# EAGLE design expansion (EAGLE 9.6.2)
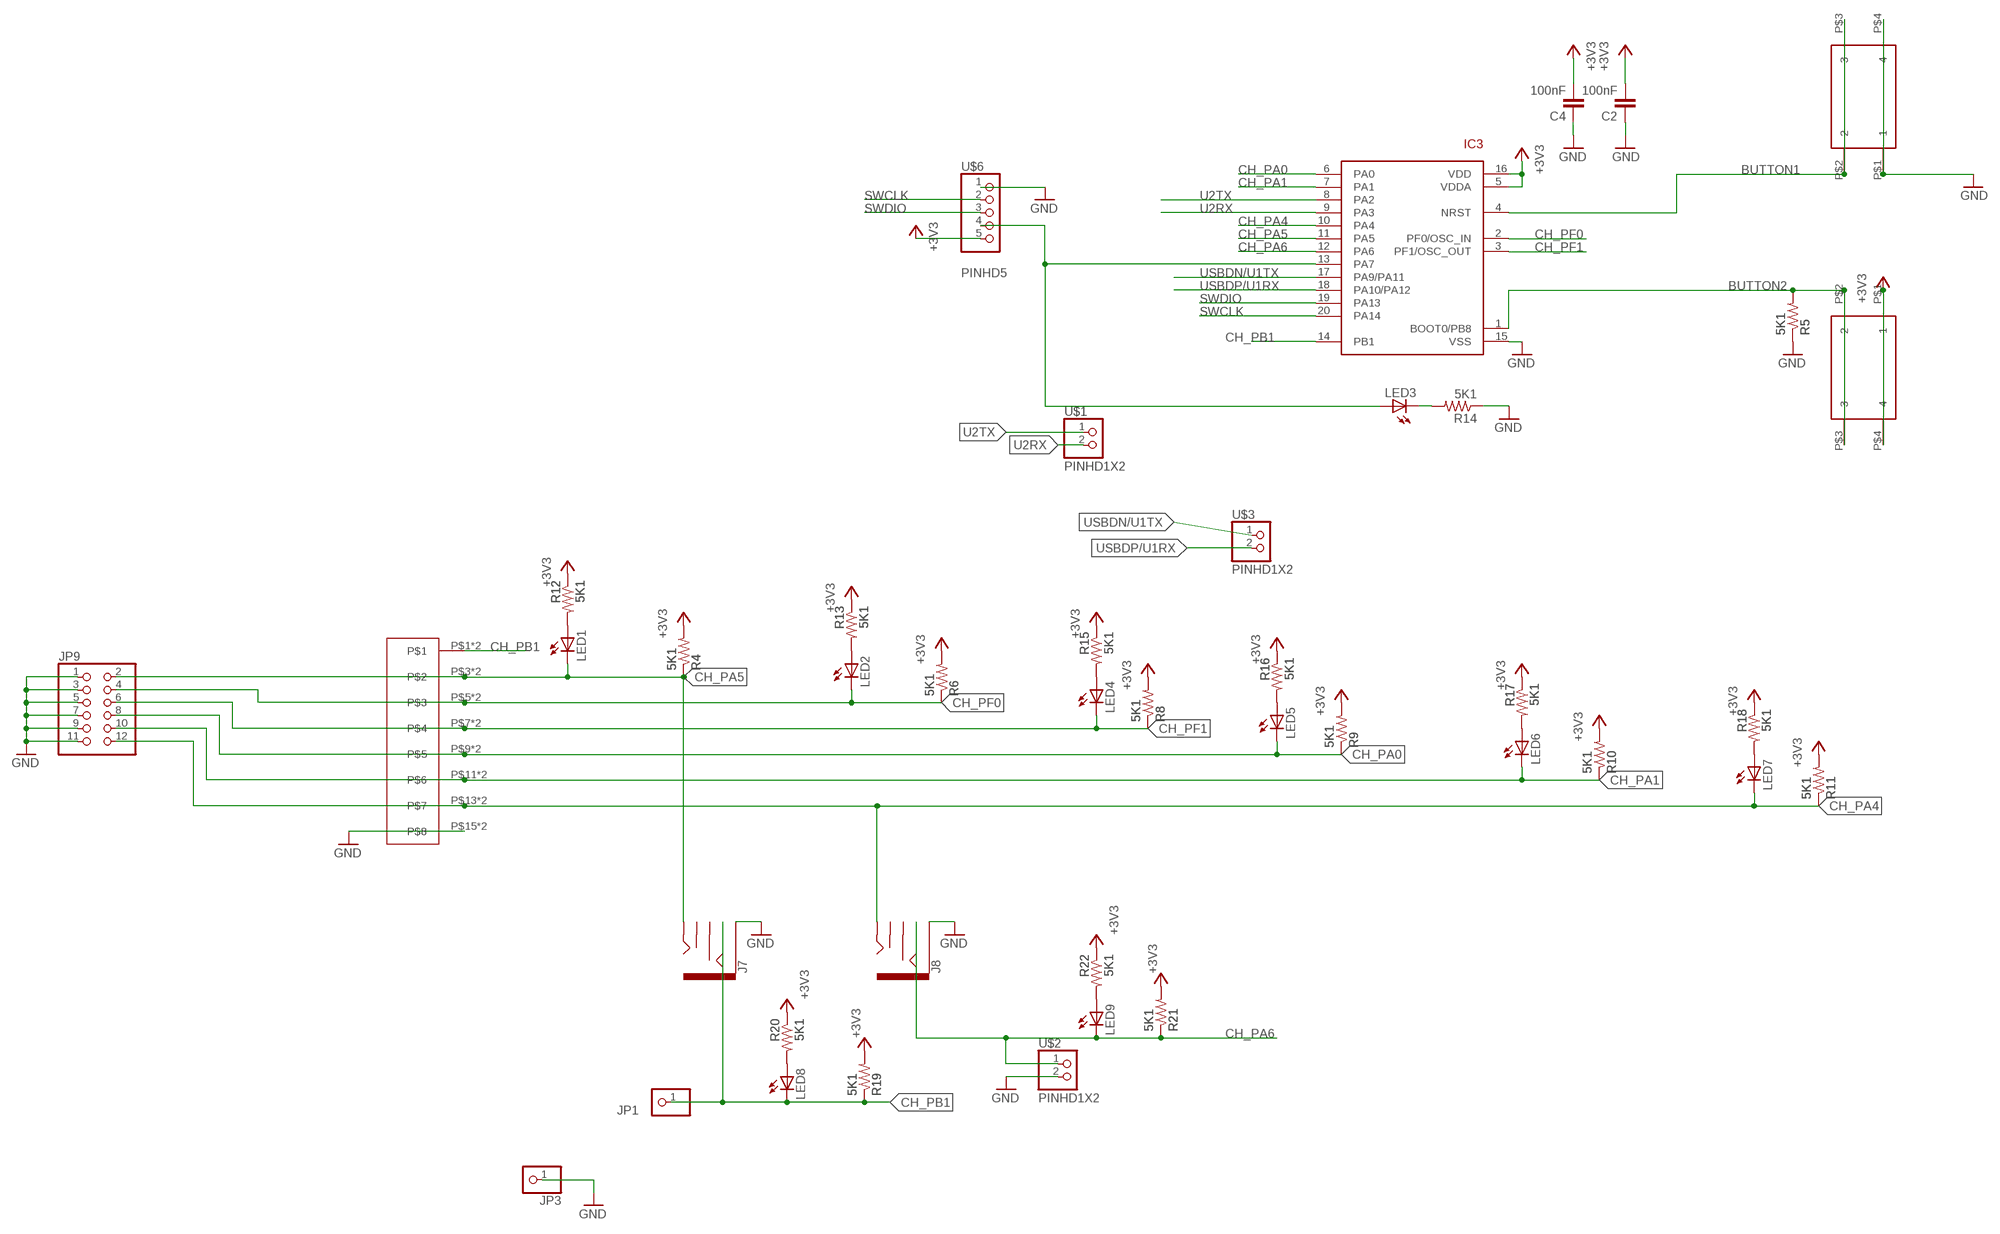
[diagram p0: schematic, sheet 1, part 1 of 2]
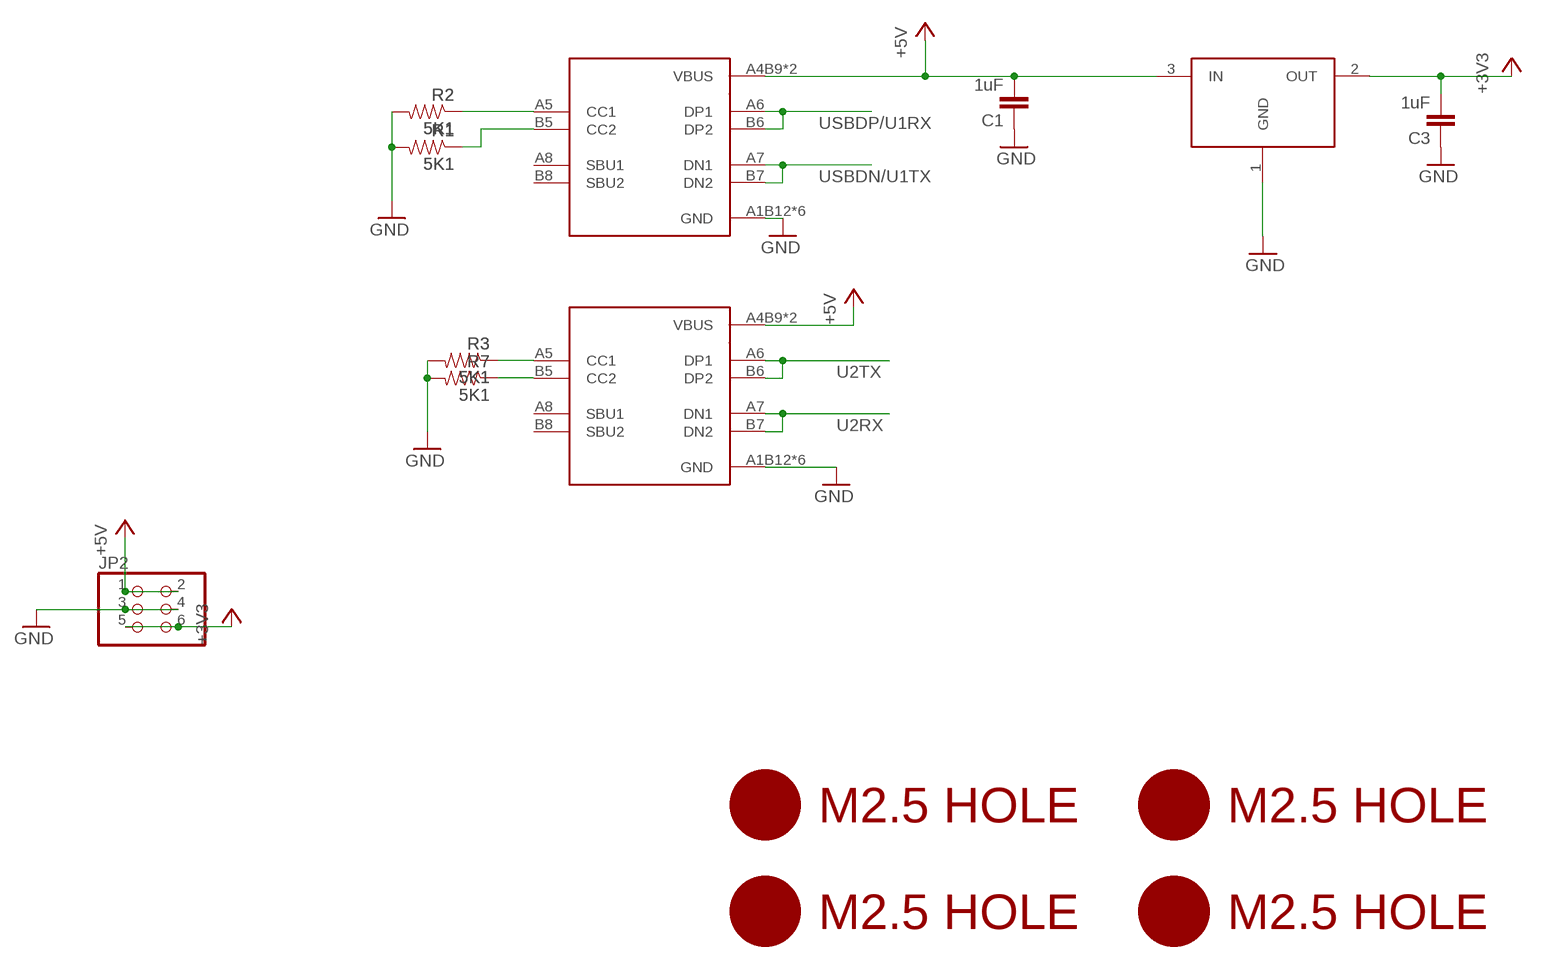
[diagram p1: schematic, sheet 1, part 2 of 2]

## Parts
C1  1uF  CAP0805  [0805]
C2  100nF  CAP0805  [0805]
C3  1uF  CAP0805  [0805]
C4  100nF  CAP0805  [0805]
IC3  STM32F042F4  [TSSOP20]
J7  AUDIO_JACK_3.5MM_PTH  [AUDIO-JACK]
J8  AUDIO_JACK_3.5MM_PTH  [AUDIO-JACK]
JP1  PINHD-1X1  [1X01]
JP2  PINHD-2X3  [2X03]
JP3  PINHD-1X1  [1X01]
JP9  PINHD-2X6  [2X06]
LED1  LEDCHIP-LED0805  [CHIP-LED0805]
LED2  LEDCHIP-LED0805  [CHIP-LED0805]
LED3  LEDCHIP-LED0805  [CHIP-LED0805]
LED4  LEDCHIP-LED0805  [CHIP-LED0805]
LED5  LEDCHIP-LED0805  [CHIP-LED0805]
LED6  LEDCHIP-LED0805  [CHIP-LED0805]
LED7  LEDCHIP-LED0805  [CHIP-LED0805]
LED8  LEDCHIP-LED0805  [CHIP-LED0805]
LED9  LEDCHIP-LED0805  [CHIP-LED0805]
R1  5K1  RESISTOR0805-RES  [0805]
R2  5K1  RESISTOR0805-RES  [0805]
R3  5K1  RESISTOR0805-RES  [0805]
R4  5K1  RESISTOR0805-RES  [0805]
R5  5K1  RESISTOR0805-RES  [0805]
R6  5K1  RESISTOR0805-RES  [0805]
R7  5K1  RESISTOR0805-RES  [0805]
R8  5K1  RESISTOR0805-RES  [0805]
R9  5K1  RESISTOR0805-RES  [0805]
R10  5K1  RESISTOR0805-RES  [0805]
R11  5K1  RESISTOR0805-RES  [0805]
R12  5K1  RESISTOR0805-RES  [0805]
R13  5K1  RESISTOR0805-RES  [0805]
R14  5K1  RESISTOR0805-RES  [0805]
R15  5K1  RESISTOR0805-RES  [0805]
R16  5K1  RESISTOR0805-RES  [0805]
R17  5K1  RESISTOR0805-RES  [0805]
R18  5K1  RESISTOR0805-RES  [0805]
R19  5K1  RESISTOR0805-RES  [0805]
R20  5K1  RESISTOR0805-RES  [0805]
R21  5K1  RESISTOR0805-RES  [0805]
R22  5K1  RESISTOR0805-RES  [0805]
SW3  324_SW  [342_SWICH_FOOT]
SW4  324_SW  [342_SWICH_FOOT]
U1  USBC_16P  [USBC_16P_FOOT]
U2  USBC_16P  [USBC_16P_FOOT]
U4  XC6206_DEV  [SOT23R_INFINEON]
U$1  PINHD1X2  [1X02]
U$2  PINHD1X2  [1X02]
U$3  PINHD1X2  [1X02]
U$6  PINHD5  [1X05]
U$8  M2.5HOLE  [M2.5HOLE]
U$9  M2.5HOLE  [M2.5HOLE]
U$10  M2.5HOLE  [M2.5HOLE]
U$11  M2.5HOLE  [M2.5HOLE]
U$14  DG2204R-5.0-8DG2204-8  [DG2204R-8]

## Nets
+3V3: C2.2 C3.2 C4.2 IC3.5(VDDA) IC3.16(VDD) JP2.5 JP2.6 R4.2 R6.2 R8.2 R9.2 R10.2 R11.2 R12.1 R13.1 R15.1 R16.1 R17.1 R18.1 R19.2 R20.1 R21.2 R22.1 SW4.P$1 SW4.P$4 U4.2(OUT) U$6.5
+5V: C1.2 JP2.1 JP2.2 U1.A4B9(VBUS) U1.B4A9(VBUS) U2.A4B9(VBUS) U2.B4A9(VBUS) U4.3(IN)
BUTTON1: IC3.4(NRST) SW3.P$2 SW3.P$3
BUTTON2: IC3.1(BOOT0/PB8) R5.2 SW4.P$2 SW4.P$3
CH_PA0: IC3.6(PA0) JP9.8 LED5.C R9.1 U$14.P$9 U$14.P$10
CH_PA1: IC3.7(PA1) JP9.10 LED6.C R10.1 U$14.P$11 U$14.P$12
CH_PA4: IC3.10(PA4) J8.TIP JP9.12 LED7.C R11.1 U$14.P$13 U$14.P$14
CH_PA5: IC3.11(PA5) J7.TIP JP9.2 LED1.C R4.1 U$14.P$3 U$14.P$4
CH_PA6: IC3.12(PA6) J8.RING LED9.C R21.1 U$2.1
CH_PB1: IC3.14(PB1) J7.RING JP1.1 LED8.C R19.1 U$14.P$1 U$14.P$2
CH_PF0: IC3.2(PF0/OSC_IN) JP9.4 LED2.C R6.1 U$14.P$5 U$14.P$6
CH_PF1: IC3.3(PF1/OSC_OUT) JP9.6 LED4.C R8.1 U$14.P$7 U$14.P$8
GND: C1.1 C2.1 C3.1 C4.1 IC3.15(VSS) J7.SLEEVE J8.SLEEVE JP2.3 JP2.4 JP3.1 JP9.1 JP9.3 JP9.5 JP9.7 JP9.9 JP9.11 R1.2 R2.2 R3.2 R5.1 R7.2 R14.1 SW3.P$1 SW3.P$4 U1.A1B12(GND) U1.B11A12(GND) U1.P$13(GND) U1.P$14(GND) U1.P$15(GND) U1.P$16(GND) U2.A1B12(GND) U2.B11A12(GND) U2.P$13(GND) U2.P$14(GND) U2.P$15(GND) U2.P$16(GND) U4.1(GND) U$2.2 U$6.1 U$14.P$15 U$14.P$16
N$1: R3.1 U1.A5(CC1)
N$2: R7.1 U1.B5(CC2)
N$3: LED1.A R12.2
N$4: LED2.A R13.2
N$5: LED4.A R15.2
N$6: LED5.A R16.2
N$7: LED6.A R17.2
N$8: LED7.A R18.2
N$9: LED8.A R20.2
N$10: IC3.13(PA7) LED3.A U$6.4
N$11: LED3.C R14.2
N$12: LED9.A R22.2
N$31: R1.1 U2.B5(CC2)
N$33: R2.1 U2.A5(CC1)
SWCLK: IC3.20(PA14) U$6.2
SWDIO: IC3.19(PA13) U$6.3
U2RX: IC3.9(PA3) U1.A7(DN1) U1.B7(DN2) U$1.2
U2TX: IC3.8(PA2) U1.A6(DP1) U1.B6(DP2) U$1.1
USBDN/U1TX: IC3.17(PA9/PA11) U2.A7(DN1) U2.B7(DN2) U$3.1
USBDP/U1RX: IC3.18(PA10/PA12) U2.A6(DP1) U2.B6(DP2) U$3.2
Unconnected: J7.RSH J7.TSH J8.RSH J8.TSH U1.A8(SBU1) U1.B8(SBU2) U2.A8(SBU1) U2.B8(SBU2)

## Library data of the parts
C1-C4 = clock:CAP: Capacitor Standard 0603 ceramic capacitor, and 0.1" leaded capacitor.
IC3 = tx:STM32F042F4
J7 J8 = SparkFun-Connectors:AUDIO_JACK_3.5MM: Audio Jack 3.5mm variants of PTH and SMT stereo audio jack with bypass switches. SparkFun Products: SparkFun SparkPunk Sound Kit <[https://www.sparkfun.com/products/11177]> - PTH MP3 Trigger <https://www.sparkfun.com/products/13720> -3.5mm SMD SparkFun PicoBoard <https://www.sparkfun.com/products/11888>- 2.5mm SMD; PROD_ID: CONN-08774; SF_ID: PRT-08032
JP1 JP3 = pinhead:PINHD-1X1: PIN HEADER
JP2 = pinhead:PINHD-2X3: PIN HEADER
JP9 = pinhead:PINHD-2X6: PIN HEADER
LED1-LED9 = adafruit:LED: LED OSRAM: - CHIPLED LG R971, LG N971, LY N971, LG Q971, LY Q971, LO R971, LY R971 LH N974, LH R974 LS Q976, LO Q976, LY Q976 LO Q996 - Hyper CHIPLED LW Q18S LB Q993, LB Q99A, LB R99A - SideLED LS A670, LO A670, LY A670, LG A670, LP A670 LB A673, LV A673, LT A673, LW A673 LH A674 LY A675 LS A676, LA A676, LO A676, LY A676, LW A676 LS A679, LY A679, LG A679 - Hyper Micro SIDELED® LS Y876, LA Y876, LO Y876, LY Y876 LT Y87S - SmartLED LW L88C, LW L88S LB L89C, LB L89S, LG L890 LS L89K, LO L89K, LY L89K LS L896, LA L896, LO L896, LY L896 - TOPLED LS T670, LO T670, LY T670, LG T670, LP T670 LSG T670, LSP T670, LSY T670, LOP T670, LYG T670 LG T671, LOG T671, LSG T671 LB T673, LV T673, LT T673, LW T673 LH T674 LS T676, LA T676, LO T676, LY T676, LB T676, LH T676, LSB T676, LW T676 LB T67C, LV T67C, LT T67C, LS T67K, LO T67K, LY T67K, LW E67C LS E67B, LA E67B, LO E67B, LY E67B, LB E67C, LV E67C, LT E67C LW T67C LS T679, LY T679, LG T679 LS T770, LO T770, LY T770, LG T770, LP T770 LB T773, LV T773, LT T773, LW T773 LH T774 LS E675, LA E675, LY E675, LS T675 LS T776, LA T776, LO T776, LY T776, LB T776 LHGB T686 LT T68C, LB T68C - Hyper Mini TOPLED® LB M676 - Mini TOPLED Santana® LG M470 LS M47K, LO M47K, LY M47K Source: http://www.osram.convergy.de/
R1-R13 R15-R22 = joyAnalog:RESISTOR: Resistor Basic schematic elements and footprints for 0603, 1206, and PTH resistors.
R14 = SparkFun-Passives:RESISTOR: Resistor Basic schematic elements and footprints for 0603, 1206, and PTH resistors.
SW3 SW4 = 3pos_slide_switch_centered:324_SW
U1 U2 = my_usbc_16p:USBC_16P
U4 = 3pos_slide_switch:XC6206_DEV
U$1-U$3 = adafruit_changed:PINHD1X2
U$6 = adafruit_changed:PINHD5
U$8-U$11 = f1c100s:M2.5HOLE
U$14 = atx4vc:DG2204R-5.0-8

## Board
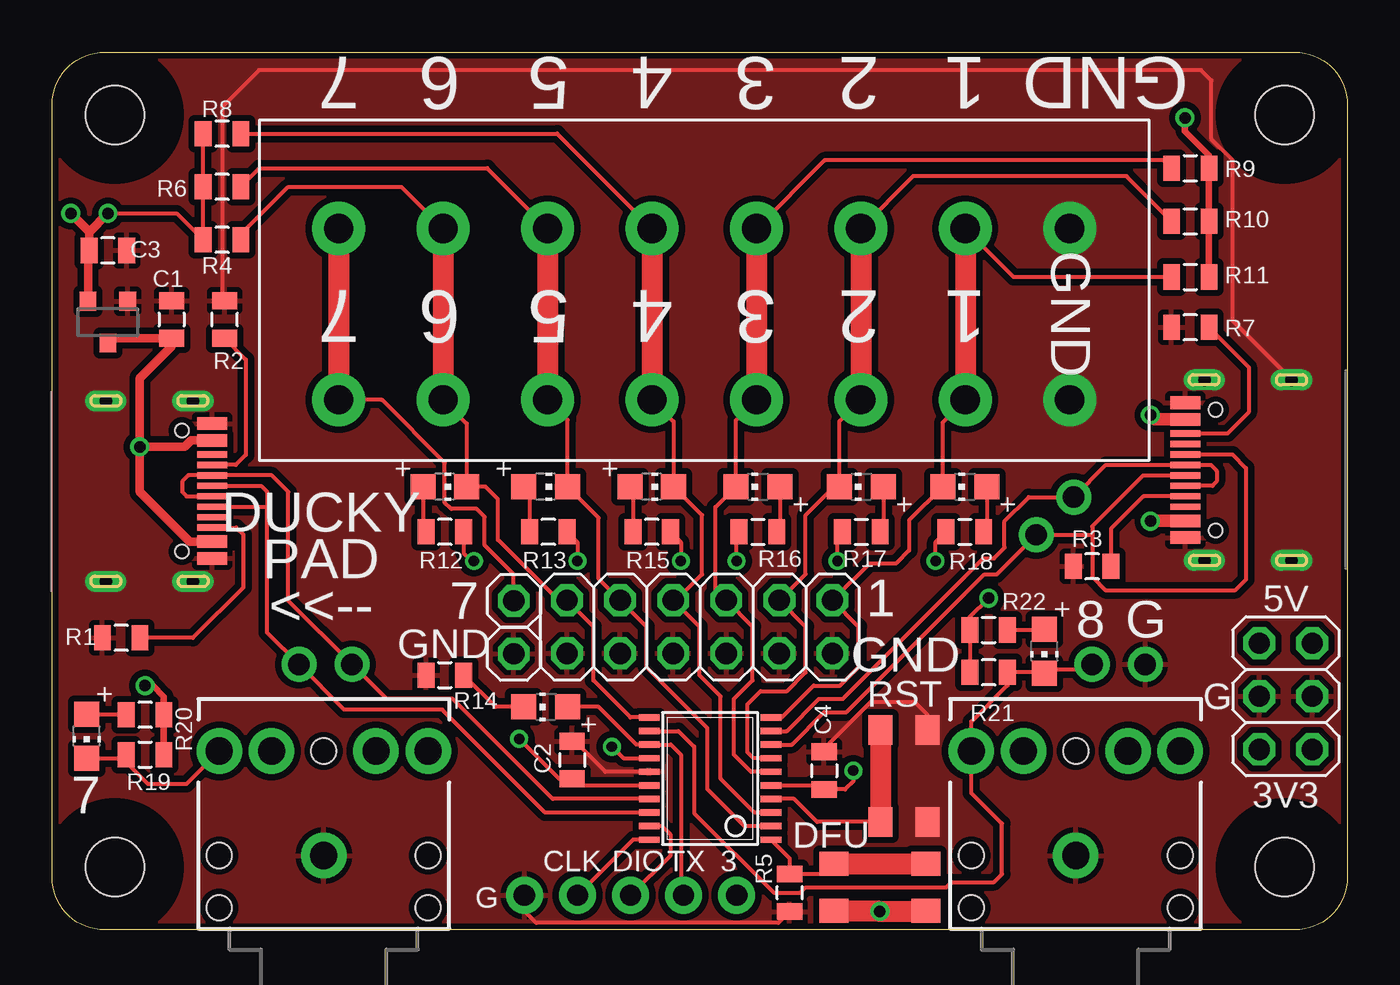
[diagram p2: board, top side]
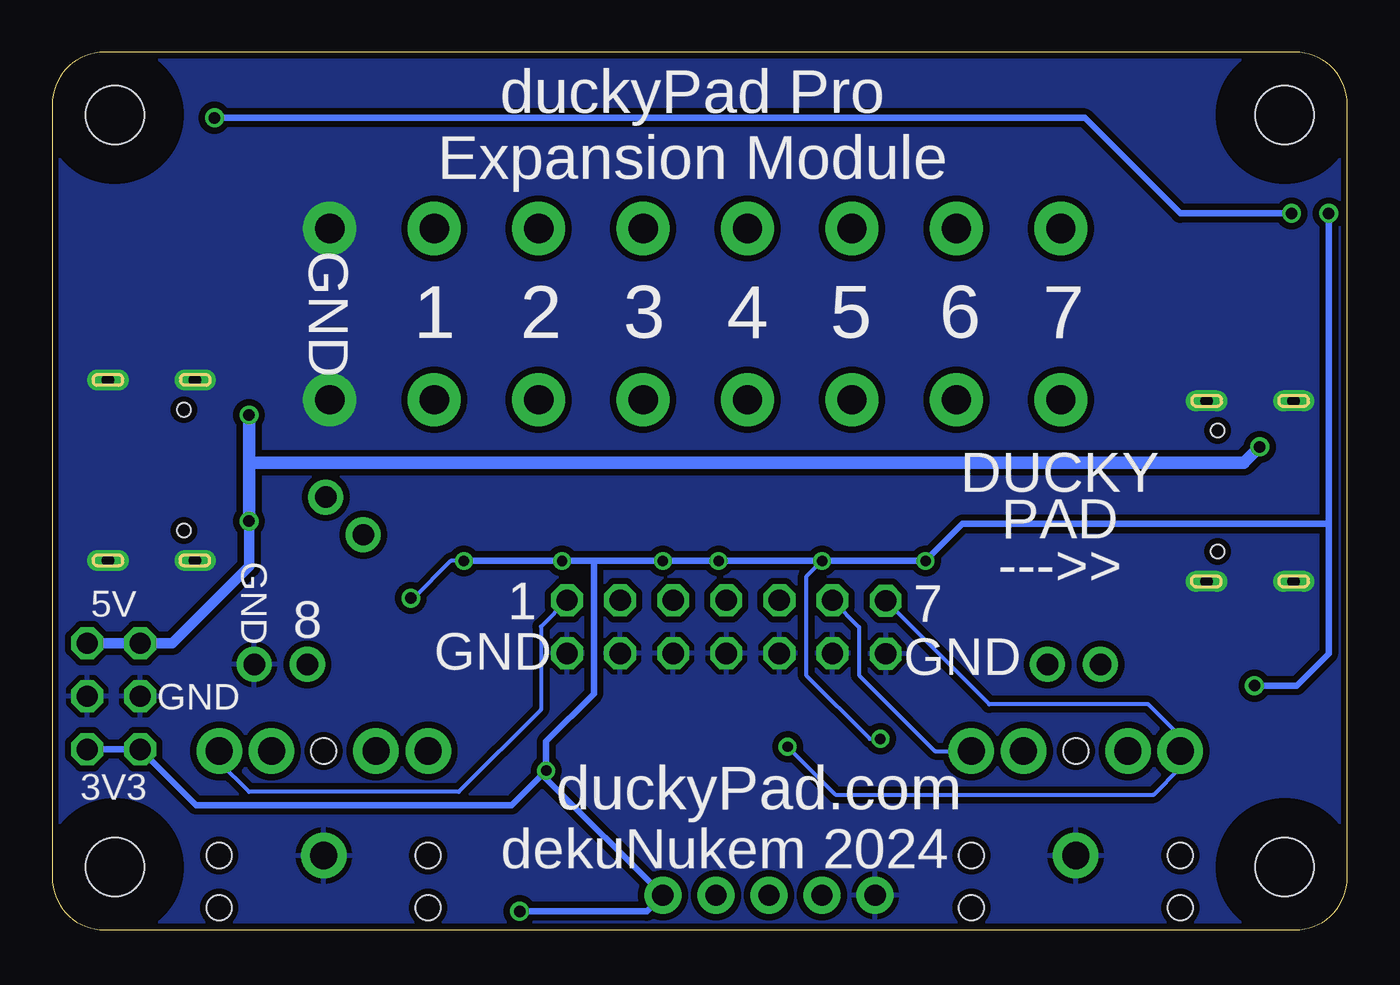
[diagram p3: board, bottom side, seen from below]

Size 62 x 42 mm. Coordinates in mm from the lower left corner, seen from the top.
Outline: 2.5,42 59.5,42 arc-90 62,39.5 62,2.5 arc-90 59.5,0 2.5,0 arc-90 0,2.5 0,39.5 arc-90 2.5,42
Copper layers (1*16): Top 0.035mm / dielectric 1.5mm / Bottom 0.035mm
Design rules "deku_2layer_6mil": minimum track width 6mil, minimum drill 15mil, track to track 6mil, track to pad 6mil, pad to pad 6mil, via to via 6mil, smd to smd 6mil, copper to edge 10mil, drill to drill 6mil, minimum pad ring 7mil, minimum via ring 7mil, stop-mask expansion 4mil, vias tented up to drill 25mil, thermal gap 10mil

### Footprints (pad centres in the part's own frame; a part is rotated, then mirrored left to right if it is on the bottom)
0805 = smd 0.8 x 1.2: 1 -0.9,0; 2 0.9,0
TSSOP20 = smd 0.305 x 0.991: 1 -2.925,-2.918; 2 -2.275,-2.918; 3 -1.625,-2.918; 4 -0.975,-2.918; 5 -0.325,-2.918; 6 0.325,-2.918; 7 0.975,-2.918; 8 1.625,-2.918; 9 2.275,-2.918; 10 2.925,-2.918; 11 2.925,2.918; 12 2.275,2.918; 13 1.625,2.918; 14 0.975,2.918; 15 0.325,2.918; 16 -0.325,2.918; 17 -0.975,2.918; 18 -1.625,2.918; 19 -2.275,2.918; 20 -2.925,2.918
AUDIO-JACK = drill 1.3 pad 2.184: RING 5,5; RSH 5,2.5; SLEEVE 0,0; TIP 5,-5; TSH 5,-2.5 | hole 1.2: 0,5; -2.5,5; -2.5,-5; 0,-5; 5,0
1X01 = drill 1.016 octagon: 1 0,0
2X03 = drill 1.016 octagon: 1 -2.54,-1.27; 2 -2.54,1.27; 3 0,-1.27; 4 0,1.27; 5 2.54,-1.27; 6 2.54,1.27
2X06 = drill 1.016 octagon: 1 -6.35,-1.27; 2 -6.35,1.27; 3 -3.81,-1.27; 4 -3.81,1.27; 5 -1.27,-1.27; 6 -1.27,1.27; 7 1.27,-1.27; 8 1.27,1.27; 9 3.81,-1.27; 10 3.81,1.27; 11 6.35,-1.27; 12 6.35,1.27
CHIP-LED0805 = smd 1.2 x 1.2: A 0,-1.05; C 0,1.05
342_SWICH_FOOT = smd 1.4 x 1.15: P$1 -2.2,-1.125; P$2 -2.2,1.125; P$3 2.2,1.125; P$4 2.2,-1.125
USBC_16P_FOOT = smd 0.6 x 1.45: A1B12 -3.225,3.848; A4B9 -2.425,3.848; B4A9 2.425,3.848; B11A12 3.225,3.848 | smd 0.3 x 1.45: A5 -1.25,3.848; A6 -0.25,3.848; A7 0.25,3.848; A8 1.25,3.848; B5 1.75,3.848; B6 0.75,3.848; B7 -0.75,3.848; B8 -1.75,3.848 | drill 0.6 pad 1 long: P$13 -4.32,2.933; P$14 4.32,2.933; P$15 -4.32,-1.248; P$16 4.32,-1.248 | hole 0.65: -2.89,2.402; 2.89,2.402
SOT23R_INFINEON = smd 0.8 x 0.9: 1 -0.95,-1; 2 0.95,-1; 3 0,1
1X02 = drill 1.016 pad 1.676: 1 -1.27,0; 2 1.27,0
1X05 = drill 1.016 pad 1.778: 1 -6.35,0; 2 -3.81,0; 3 -1.27,0; 4 1.27,0; 5 3.81,0
M2.5HOLE = hole 2.8: 0,0
DG2204R-8 = drill 1.4 pad 2.54: P$1 -15,4.1; P$2 -15,-4.1; P$3 -10,4.1; P$4 -10,-4.1; P$5 -5,4.1; P$6 -5,-4.1; P$7 0,4.1; P$8 0,-4.1; P$9 5,4.1; P$10 5,-4.1; P$11 10,4.1; P$12 10,-4.1; P$13 15,4.1; P$14 15,-4.1; P$15 20,4.1; P$16 20,-4.1

### Placement (x,y rotation side)
C1  5.71,29.21 270 top
C2  24.89,8.13 270 top
C3  2.67,32.51 180 top
C4  36.96,7.62 270 top
IC3  31.5,7.24 90 top
J7  13,3.56 90 top
J8  49,3.56 90 top
JP1  22.1,15.75 0 top
JP2  59.05,11.18 270 top
JP3  22.1,13.21 0 top
JP9  31,14.5 0 top
LED1  18.8,21.21 270 top
LED2  23.62,21.21 270 top
LED3  23.62,10.67 90 top
LED4  28.7,21.21 270 top
LED5  33.78,21.21 90 top
LED6  38.73,21.21 90 top
LED7  43.69,21.21 90 top
LED8  1.65,9.27 180 top
LED9  47.5,13.34 180 top
R1  3.3,13.97 180 top
R2  8.26,29.21 90 top
R3  49.78,17.4 180 top
R4  8.13,33.02 180 top
R5  35.31,1.78 90 top
R6  8.13,35.56 180 top
R7  54.48,28.83 180 top
R8  8.13,38.1 180 top
R9  54.48,36.45 0 top
R10  54.48,33.91 0 top
R11  54.48,31.24 0 top
R12  18.8,19.05 180 top
R13  23.75,19.05 180 top
R14  18.8,12.19 0 top
R15  28.7,19.05 180 top
R16  33.78,19.05 0 top
R17  38.73,19.05 0 top
R18  43.69,19.05 0 top
R19  4.45,8.38 0 top
R20  4.45,10.29 180 top
R21  44.83,12.32 180 top
R22  44.83,14.35 0 top
SW3  40.77,7.37 90 top
SW4  39.62,2.03 0 top
U1  58.09,22 90 top
U2  3.81,21 270 top
U4  2.67,29.08 180 top
U$1  48.01,19.81 45 top
U$2  51.05,12.7 0 top
U$3  13.08,12.7 180 top
U$6  28.96,1.65 0 top
U$8  3,3 0 top
U$9  3,39 0 top
U$10  59,3 0 top
U$11  59,39 0 top
U$14  28.71,29.46 0 top

### Tracks (layer width: path | path; a pad name or v marks a point on that pad's centre or on a via)
+3V3  (via drill 0.5, 0.55)
  Top 0.203: v2.67,34.29 5.96,34.29 R4.2 R6.2 R8.2 | v42.29,17.65 42.29,18.55 R18.1 | v37.59,17.65 37.59,18.81 R17.1 | v32.77,17.65 32.77,18.93 R16.1 | R15.1 30.1,18.55 v30.1,17.65 | R13.1 25.15,18.55 v25.15,17.65 | R12.1 19.7,18.03 20.08,17.65 v20.19,17.65 | v38.35,7.62 38.35,7.11 37.96,6.72 C4.2 36.76,6.91 IC3.5 | IC3.16 25.21,6.91 C2.2 24.27,7.23 v22.35,9.14 | v44.83,15.88 43.93,14.97 R22.1 R21.2
  Top 0.305: v54.23,38.86 54.23,38.23 55.38,37.07 R9.2 R10.2 R11.2 | v4.45,11.68 4.83,11.68 5.34,11.16 R20.1 R19.2
  Top 0.406: U4.2 1.72,32.46 C3.2 | C3.2 1.77,33.41 v0.89,34.29 | C3.2 1.77,33.39 v2.67,34.29
  Top 1.016: SW4.P$1 37.44,0.89 v39.62,0.89 41.81,0.89 SW4.P$4
  Bottom 0.203: v25.15,17.65 25.91,16.89 25.91,12.19 22.86,9.14 v22.35,9.14 | v42.29,17.65 42.93,17.65 44.7,15.88 v44.83,15.88
  Bottom 0.305: v2.67,34.29 8,34.29 12.57,38.86 v54.23,38.86 | 36.07,17.65 v32.77,17.65 v30.1,17.65 v25.15,17.65 v20.19,17.65 18.41,19.43 0.89,19.43 | 36.07,17.65 v37.59,17.65 v42.29,17.65 | v38.35,7.62 38.35,9.02 36.07,11.3 36.07,17.65 | v38.35,7.62 38.35,7.24 U$6.5 33.53,0.89 v39.62,0.89 | v38.35,7.62 40.01,5.97 55.12,5.97 JP2.5 JP2.6 | v4.45,11.68 2.41,11.68 0.89,13.21 0.89,19.43 | v0.89,34.29 0.89,19.43
+5V  (via drill 0.55)
  Top 0.406: U2.B4A9 6.57,18.57 4.19,20.95 v4.19,23.11 | U2.A4B9 6.66,23.43 6.35,23.11 v4.19,23.11 | U4.3 2.89,28.31 C1.2 5.71,27.93 4.19,26.41 v4.19,23.11
  Top 0.61: v52.58,19.56 52.59,19.57 U1.A4B9 | U1.B4A9 52.79,24.43 v52.58,24.64
  Bottom 0.508: v52.58,19.56 52.58,17.4 56.26,13.72 JP2.1 JP2.2
  Bottom 0.61: v4.19,23.11 4.95,22.35 52.58,22.35 | 52.58,22.35 v52.58,19.56 | 52.58,22.35 v52.58,24.64
BUTTON1
  Top 0.203: SW3.P$2 39.62,5.17 36.62,5.17 35.52,6.26 IC3.4
  Top 1.016: SW3.P$3 39.64,5.18 39.62,5.17
BUTTON2
  Top 0.203: IC3.1 35.31,3.42 R5.2 36.95,2.68 SW4.P$2
  Top 1.016: SW4.P$2 SW4.P$3
CH_PA0
  Top 0.203: IC3.6 33.46,7.56 32.64,8.38 32.64,11.05 33.53,11.94 33.53,14.51 JP9.8 31.75,16.29 31.75,20.23 LED5.C 32.73,24.39 U$14.P$10 | R9.1 53.2,36.83 36.98,36.83 U$14.P$9
  Top 1.016: U$14.P$9 U$14.P$10
CH_PA1
  Top 0.203: IC3.7 33.57,8.21 33.27,8.51 33.27,10.79 33.91,11.43 35.18,11.43 36.07,12.32 36.07,14.51 JP9.10 36.07,17.03 36.07,19.85 37.43,21.21 LED6.C 37.69,24.34 U$14.P$12 | R10.1 51.42,36.07 41.21,36.07 U$14.P$11
  Top 1.016: U$14.P$11 U$14.P$12
CH_PA4
  Top 0.203: U$14.P$14 42.64,24.29 LED7.C 41.02,19.59 41.02,18.16 40.39,17.53 39.12,17.53 JP9.12 38.61,14.51 38.61,12.57 37.72,11.68 36.45,11.68 34.93,10.16 IC3.10 | R11.1 46.03,31.24 U$14.P$13
  Top 1.016: U$14.P$13 U$14.P$14
  Bottom 0.203: JP9.12 38.61,14.51 38.61,10.54 42.55,6.6 52.58,6.6 54,8.03 J8.TIP
CH_PA5
  Top 0.203: IC3.11 27.68,10.16 25.91,11.94 25.91,14.51 JP9.2 24.23,15.77 21.34,18.67 21.34,20.61 20.73,21.21 LED1.C 19.85,24.23 U$14.P$4 | R4.1 9.03,33.28 11.3,35.56 16.71,35.56 U$14.P$3
  Top 1.016: U$14.P$3 U$14.P$4
  Bottom 0.203: JP9.2 23.37,14.49 23.37,12.19 19.73,8.56 J7.TIP
CH_PA6
  Top 0.203: IC3.12 29.98,9.51 30.73,8.76 30.73,5.59 34.54,1.78 35.81,1.78 36.07,2.03 42.8,2.03 43.05,2.29 45.09,2.29 45.47,2.67 45.47,5.08 44,6.55 J8.RING 44,9.96 45.73,11.7 R21.1 47.46,12.32 LED9.C 47.66,12.45 49.53,12.45 U$2.1
CH_PB1  (via drill 0.5)
  Top 0.203: v26.8,8.76 27.35,8.21 IC3.14 | LED8.C 3.38,8.22 R19.1 3.54,8.01 4.57,6.99 6.43,6.99 J7.RING | JP1.1 22.1,17.02 20.7,18.41 20.7,19.76 20.32,20.14 19.1,20.14 18.8,20.45 18.8,22.35 15.78,25.36 U$14.P$2
  Top 1.016: U$14.P$1 U$14.P$2
  Bottom 0.203: v26.8,8.76 24.51,6.48 9.27,6.48 8,7.75 J7.RING 8,9.27 9.53,10.79 17.14,10.79 JP1.1
CH_PF0
  Top 0.203: IC3.2 33.14,4.96 31.37,6.73 31.37,9.65 28.45,12.57 28.45,14.51 JP9.4 26.16,16.8 26.16,19.72 LED2.C 24.67,24.4 U$14.P$6 | R6.1 9.92,36.45 20.82,36.45 U$14.P$5
  Top 1.016: U$14.P$5 U$14.P$6
CH_PF1
  Top 0.203: IC3.3 33.63,5.61 32,7.24 32,11.18 30.99,12.19 30.99,14.51 JP9.6 29.87,15.77 31.11,17.02 31.11,19.85 LED4.C 29.75,24.32 U$14.P$8 | R8.1 24.17,38.1 U$14.P$7
  Top 1.016: U$14.P$7 U$14.P$8
GND
  Top 0.203: IC3.15 26.48,7.56 25.02,9.03 C2.1 | R5.1 34.76,0.33 23.16,0.33 22.61,0.89 U$6.1 | C4.1 36.96,8.67 39.21,10.92 41.27,10.92 41.89,10.3 SW3.P$4 | U1.P$16 56.52,29.14 56.52,36.83 55.5,37.85 55.5,40.64 54.99,41.15 9.91,41.15 8.13,39.37 8.13,30.24 R2.2
  pour Top (isolate 0.305): -10.85,56 -10.85,-12 116.64,-12 116.64,56
  pour Bottom (isolate 0.305): -10,51 106,51 106,-8 -10,-8
N$1
  Top 0.203: U1.A5 52.25,20.75 50.68,19.19 R3.1
N$2
  Top 0.203: R7.1 57.28,26.93 57.28,24.77 56.26,23.75 U1.B5
N$3
  Top 0.203: LED1.A 17.75,19.2 R12.2
N$4
  Top 0.203: LED2.A 22.85,20.93 R13.2
N$5
  Top 0.203: LED4.A 27.8,21.06 R15.2
N$6
  Top 0.203: LED5.A 34.83,19.2 R16.2
N$7
  Top 0.203: LED6.A 39.78,19.2 R17.2
N$8
  Top 0.203: LED7.A 44.74,19.2 R18.2
N$9
  Top 0.203: LED8.A 3.51,10.32 R20.2
N$10
  Top 0.203: U$6.4 30.1,1.78 30.1,8.38 29.62,8.86 IC3.13 27.97,8.86 26.16,10.67 LED3.A
N$11
  Top 0.203: LED3.C 21.22,10.67 R14.2
N$12
  Top 0.203: R22.2 47.46,14.35 LED9.A
N$31
  Top 0.203: U2.B5 8.82,19.25 9.14,18.92 9.14,16.38 6.73,13.97 R1.1
N$33
  Top 0.203: R2.1 9.27,27.29 9.27,22.73 8.79,22.25 U2.A5
SWCLK
  Top 0.203: IC3.20 27.81,4.31 U$6.2
SWDIO
  Top 0.203: U$6.3 29.59,3.56 29.59,4.57 29.2,4.96 IC3.19
U2RX
  Top 0.203: IC3.9 35.17,9.51 36.7,11.05 37.85,11.05 44.58,17.78 45.09,17.78 45.59,18.29 45.59,19.56 46.74,20.71 U$1.2 50.44,22.25 U1.A7 55.47,22.25 55.75,21.97 55.75,21.46 55.54,21.25 U1.B7
U2TX
  Top 0.203: IC3.8 35.41,8.86 36.96,10.41 38.02,10.41 44.63,17.02 45.22,17.02 U$1.1 | 49.78,18.92 49.77,18.91 U$1.1 | U1.A6 52.23,21.75 49.78,19.3 49.78,18.92 | U1.B6 56.5,22.75 57.15,22.1 57.15,16.76 56.64,16.26 50.42,16.26 49.78,16.89 49.78,18.92 | U$1.1
USBDN/U1TX
  Top 0.203: U2.A7 6.43,20.75 6.22,20.95 6.22,21.46 6.51,21.75 U2.B7 10.51,21.75 11.3,20.95 11.3,15.75 U$3.1 16,11.05 19.18,11.05 23.96,6.26 IC3.17
USBDP/U1RX
  Top 0.203: U2.A6 9.99,21.25 10.29,20.95 10.29,20.25 | U2.B6 10.29,20.25 | IC3.18 23.6,5.61 18.67,10.54 13.97,10.54 U$3.2 10.29,14.22 10.29,20.25

### Text on the board
tNames: 7 | 6 | 5 | 4 | 3 | 2 | 1 | GND | 7 | 6 | 5 | 4 | 3 | 2 | 1 | GND | DUCKY / PAD / <<-- | 7 | 1 | 5V | 8 | G | GND | GND | RST | G | 7 | 3V3 | DFU | CLK | DIO | TX | 3 | G
bNames: duckyPad Pro / Expansion Module | 7 | 6 | 5 | 4 | 3 | 2 | 1 | GND | DUCKY / PAD / --->> | 7 | 1 | GND | 5V | 8 | GND | GND | GND | duckyPad.com | 3V3 | dekuNukem 2024